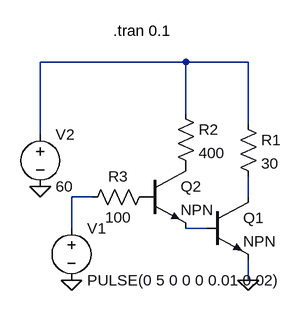
[diagram p0: schematic DarlingtonPairSmallBJTturnOnLargePowerTransistor.asc]
DarlingtonPairSmallBJTturnOnLargePowerTransistor.asc, the LTspice schematic file:
Version 4.1
SHEET 1 880 680
WIRE 128 -32 -96 -32
WIRE 224 -32 128 -32
WIRE 128 48 128 -32
WIRE 224 64 224 -32
WIRE -96 80 -96 -32
WIRE -16 176 -48 176
WIRE 224 176 224 144
WIRE -48 224 -48 176
WIRE 160 224 128 224
WIRE 224 304 224 272
FLAG -96 160 0
FLAG 224 304 0
FLAG -48 304 0
SYMBOL npn 160 176 R0
SYMATTR InstName Q1
SYMBOL res 208 48 R0
SYMATTR InstName R1
SYMATTR Value 30
SYMBOL voltage -96 64 R0
WINDOW 123 0 0 Left 0
WINDOW 39 0 0 Left 0
SYMATTR InstName V2
SYMATTR Value 60
SYMBOL npn 64 128 R0
SYMATTR InstName Q2
SYMBOL res 112 32 R0
SYMATTR InstName R2
SYMATTR Value 400
SYMBOL voltage -48 208 R0
WINDOW 123 0 0 Left 0
WINDOW 39 0 0 Left 0
SYMATTR InstName V1
SYMATTR Value PULSE(0 5 0 0 0 0.01 0.02)
SYMBOL res 80 160 R90
WINDOW 0 0 56 VBottom 2
WINDOW 3 32 56 VTop 2
SYMATTR InstName R3
SYMATTR Value 100
TEXT 16 -80 Left 2 !.tran 0.1

The netlist it stands for:
* DarlingtonPairSmallBJTturnOnLargePowerTransistor.asc
Q1 N003 N004 0 0 NPN
R1 N001 N003 30
V2 N001 0 60
Q2 P001 P002 N004 0 NPN
R2 N001 P001 400
V1 N002 0 PULSE(0 5 0 0 0 0.01 0.02)
R3 P002 N002 100
.model NPN NPN
.model PNP PNP
.lib standard.bjt
.tran 0.1
.backanno
.end